# EAGLE schematic riffle-CTD-REVA (EAGLE 6.5.0)
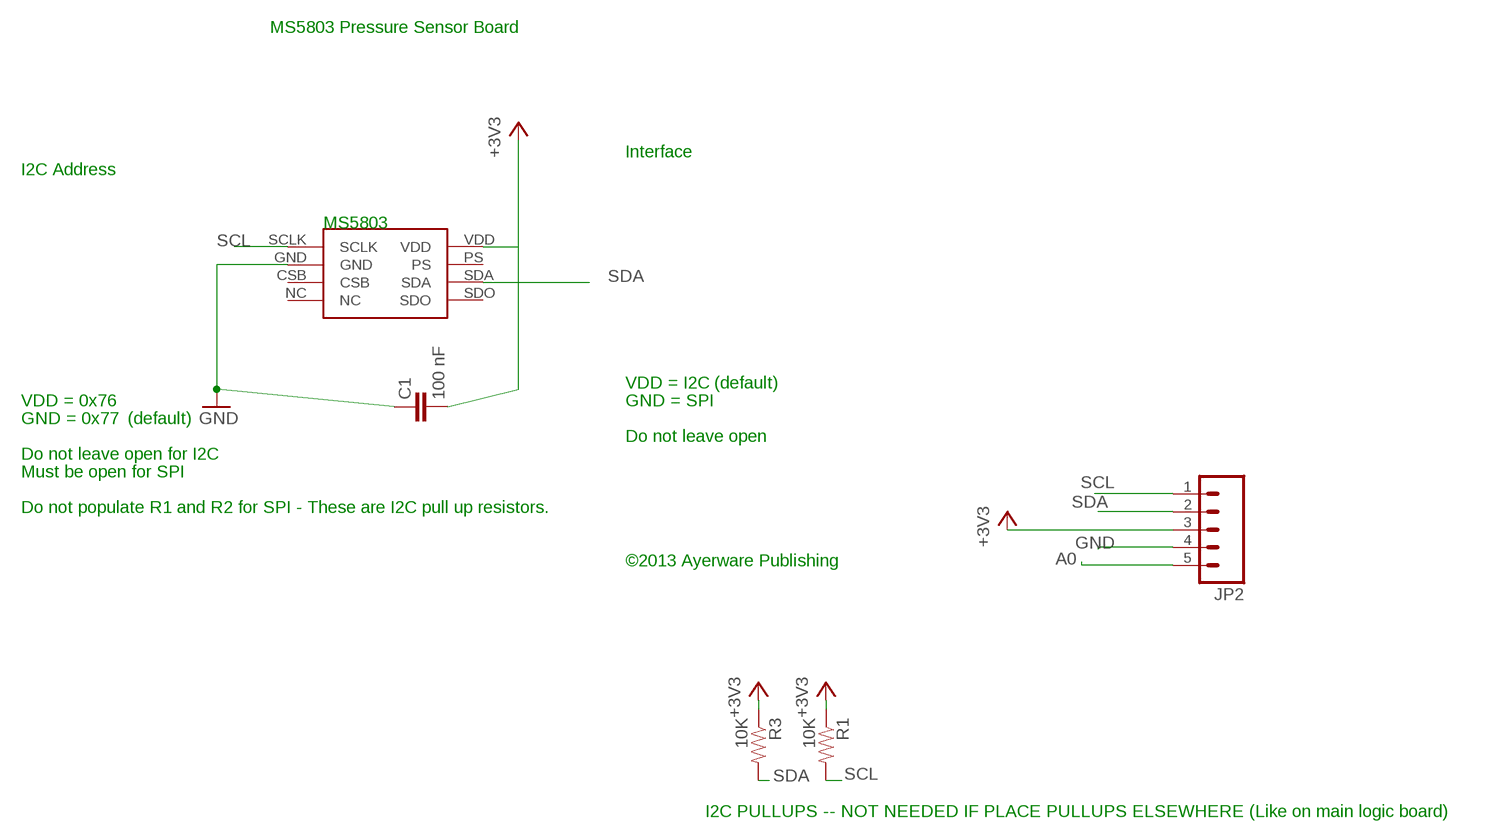
[diagram p0: schematic, sheet 1]

## Parts
C1  100 nF  CAP0402-CAP  [0402-CAP]
JP2  M05PTH  [1X05]
MS5803  MS5803-14BA  [MS5803-14BA]
R1  10K  RESISTOR0402-RES  [0402-RES]
R3  10K  RESISTOR0402-RES  [0402-RES]

## Nets
+3V3: C1.1 JP2.3 MS5803.VDD R1.1 R3.1
A0: JP2.5
GND: C1.2 JP2.4 MS5803.GND
SCL: JP2.1 MS5803.SCLK R1.2
SDA: JP2.2 MS5803.SDA R3.2
Unconnected: MS5803.CSB MS5803.NC MS5803.PS MS5803.SDO

## Notes on the sheet
- MS5803 Pressure Sensor Board
- Interface
- I2C Address
- MS5803
- VDD = I2C | (default)
- VDD = 0x76 | GND = SPI
- GND = 0x77 | (default)
- Do not leave open
- Do not leave open for I2C
- Must be open for SPI
- Do not populate R1 and R2 for SPI - These are I2C pull up resistors.
- ©2013 Ayerware Publishing
- I2C PULLUPS -- NOT NEEDED IF PLACE PULLUPS ELSEWHERE (Like on main logic board)

## Library data of the parts
C1 = SparkFun:CAP: Capacitor Standard 0603 ceramic capacitor, and 0.1" leaded capacitor.
JP2 = SparkFun-Connectors:M05: Header 5 Standard 5-pin 0.1" header. Use with straight break away headers (SKU : PRT-00116), right angle break away headers (PRT-00553), swiss pins (PRT-00743), machine pins (PRT-00117), and female headers (PRT-00115). Molex polarized connector foot print use with SKU : PRT-08230 with associated crimp pins and housings.
MS5803 = Vic's Library:MS5803-14BA
R1 R3 = SparkFun:RESISTOR: Resistor Basic schematic elements and footprints for 0603, 1206, and PTH resistors.

## Net classes
0 default: width 0.203 mm, drill 0.33 mm, clearance 0.203 mm
1 power: width 0.381 mm, drill 0.33 mm, clearance 0.254 mm